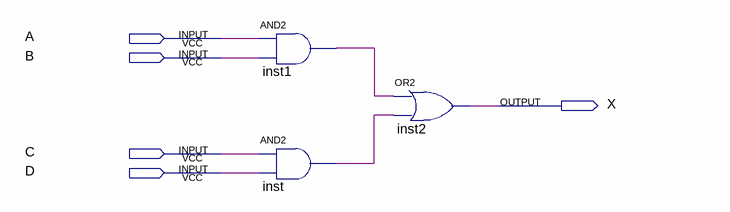
[diagram p0: schematic sheet]
// Quartus schematic fig5_1.bdf as structural Verilog: 3 symbols, 5 pins
module fig5_1 (
  input  A,
  input  B,
  input  C,
  input  D,
  output X
);

  wire inst1_out, inst_out;

  and inst1 (inst1_out, A, B);
  and inst (inst_out, C, D);
  or inst2 (X, inst1_out, inst_out);
endmodule
